# EAGLE design business card serial conway (EAGLE 9.2.2)
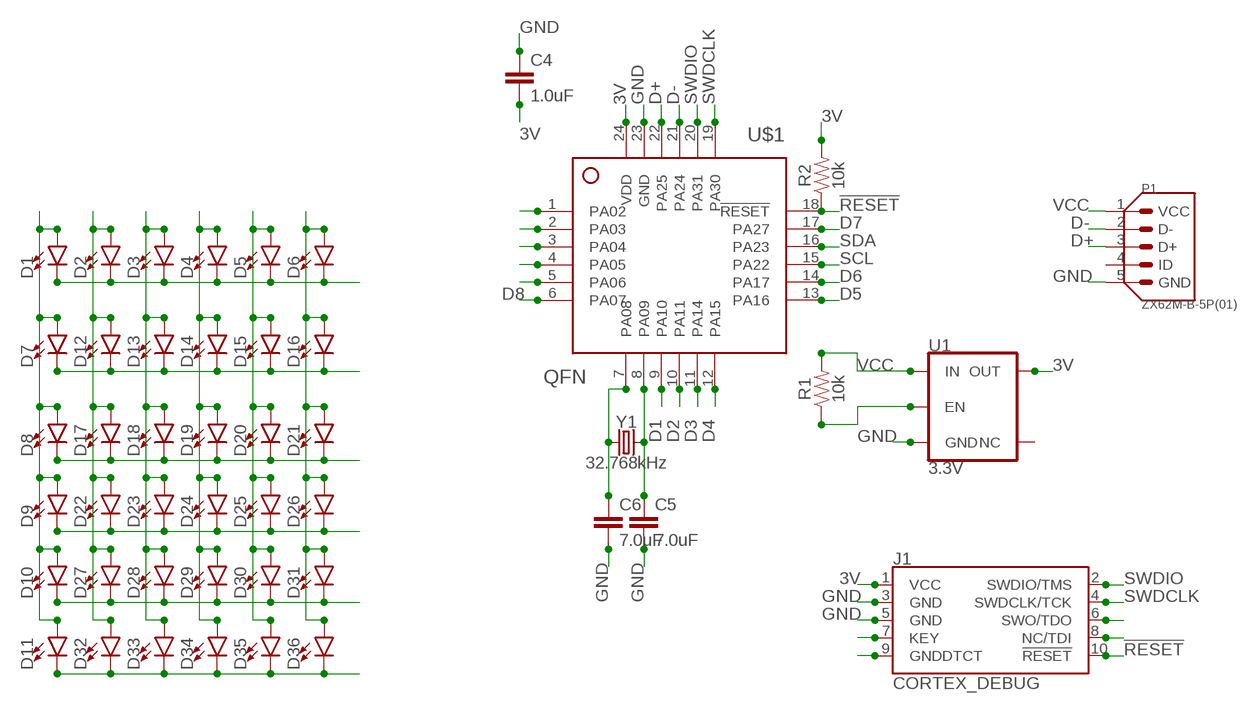
[diagram p0: schematic, sheet 1]

## Parts
C4  1.0uF  1.0UF-0402-16V-10%  [0402]
C5  7.0uF  1.0UF-0402-16V-10%  [0402]
C6  7.0uF  1.0UF-0402-16V-10%  [0402]
D1  LED0603  [LED-0603]
D2  LED0603  [LED-0603]
D3  LED0603  [LED-0603]
D4  LED0603  [LED-0603]
D5  LED0603  [LED-0603]
D6  LED0603  [LED-0603]
D7  LED0603  [LED-0603]
D8  LED0603  [LED-0603]
D9  LED0603  [LED-0603]
D10  LED0603  [LED-0603]
D11  LED0603  [LED-0603]
D12  LED0603  [LED-0603]
D13  LED0603  [LED-0603]
D14  LED0603  [LED-0603]
D15  LED0603  [LED-0603]
D16  LED0603  [LED-0603]
D17  LED0603  [LED-0603]
D18  LED0603  [LED-0603]
D19  LED0603  [LED-0603]
D20  LED0603  [LED-0603]
D21  LED0603  [LED-0603]
D22  LED0603  [LED-0603]
D23  LED0603  [LED-0603]
D24  LED0603  [LED-0603]
D25  LED0603  [LED-0603]
D26  LED0603  [LED-0603]
D27  LED0603  [LED-0603]
D28  LED0603  [LED-0603]
D29  LED0603  [LED-0603]
D30  LED0603  [LED-0603]
D31  LED0603  [LED-0603]
D32  LED0603  [LED-0603]
D33  LED0603  [LED-0603]
D34  LED0603  [LED-0603]
D35  LED0603  [LED-0603]
D36  LED0603  [LED-0603]
J1  CORTEX_DEBUG  CORTEX_DEBUG_PTH  [2X5-PTH-1.27MM]
P1  ZX62M-B-5P(01)  [HRS_ZX62M-B-5P(01)]
R1  10k  330OHM-0603-1/10W-1%  [0603]
R2  10k  330OHM-0603-1/10W-1%  [0603]
U1  3.3V  V_REG_AP2112K-3.3V  [SOT23-5]
U$1  QFN  [QFN24-4X4]
Y1  32.768kHz  CRYSTAL-32.768KHZSMD-3.2X1.5  [CRYSTAL-SMD-3.2X1.5MM]

## Nets
3V: C4.2 J1.1(VCC) R2.2 U1.5(OUT) U$1.24(VDD)
!RESET: J1.10(!RESET) R2.1 U$1.18(!RESET)
D1: U$1.9(PA10)
D2: U$1.10(PA11)
D3: U$1.11(PA14)
D4: U$1.12(PA15)
D5: U$1.13(PA16)
D6: U$1.14(PA17)
D7: U$1.17(PA27)
D8: U$1.6(PA07)
D+: P1.3(D+) U$1.22(PA25)
D-: P1.2(D-) U$1.21(PA24)
GND: C4.1 C5.2 C6.2 J1.3(GND) J1.5(GND) P1.5(GND) U1.2(GND) U$1.23(GND)
N$1: D1.C D2.C D3.C D4.C D5.C D6.C
N$2: C6.1 U$1.7(PA08) Y1.P$1
N$3: C5.1 U$1.8(PA09) Y1.P$2
N$4: J1.9(GNDDTCT)
N$5: R1.1 U1.3(EN)
N$6: D7.C D12.C D13.C D14.C D15.C D16.C
N$7: J1.8(NC/TDI)
N$8: D8.C D17.C D18.C D19.C D20.C D21.C
N$9: J1.7(KEY)
N$10: J1.6(SWO/TDO)
N$11: D9.C D22.C D23.C D24.C D25.C D26.C
N$12: D10.C D27.C D28.C D29.C D30.C D31.C
N$13: D11.C D32.C D33.C D34.C D35.C D36.C
N$14: D1.A D7.A D8.A D9.A D10.A D11.A
N$15: D2.A D12.A D17.A D22.A D27.A D32.A
N$16: D3.A D13.A D18.A D23.A D28.A D33.A
N$17: D4.A D14.A D19.A D24.A D29.A D34.A
N$18: D5.A D15.A D20.A D25.A D30.A D35.A
N$19: D6.A D16.A D21.A D26.A D31.A D36.A
N$21: U$1.1(PA02)
N$22: U$1.2(PA03)
N$23: U$1.3(PA04)
N$24: U$1.4(PA05)
N$25: U$1.5(PA06)
SCL: U$1.15(PA22)
SDA: U$1.16(PA23)
SWDCLK: J1.4(SWDCLK/TCK) U$1.19(PA30)
SWDIO: J1.2(SWDIO/TMS) U$1.20(PA31)
VCC: P1.1(VCC) R1.2 U1.1(IN)
Unconnected: P1.4(ID) U1.4(NC)

## Library data of the parts
C4 = SparkFun-Capacitors:1.0UF: 1µF ceramic capacitors A capacitor is a passive two-terminal electrical component used to store electrical energy temporarily in an electric field.; PROD_ID: CAP-12417
C5 C6 = SparkFun-Capacitors:1.0UF: 1µF ceramic capacitors A capacitor is a passive two-terminal electrical component used to store electrical energy temporarily in an electric field.; PROD_ID: CAP-12417; VALUE: 1.0uF
D1-D36 = SparkFun-LED:LED: LED (Generic) Standard schematic elements and footprints for 5mm, 3mm, 1206, and 0603 sized LEDs. Generic LEDs with no color specified.
J1 = SparkFun-Connectors:CORTEX_DEBUG: Cortex Debug Connector - 10 pin Supports JTAG debug, Serial Wire debug, and Serial Wire Viewer. PTH and SMD connector options available. General Connector Information <http://infocenter.arm.com/help/topic/com.arm.doc.faqs/attached/13634/cortex_debug_connectors.pdf> Products: PTH Connector <http://www.digikey.com/product-detail/en/cnc-tech/3220-10-0100-00/1175-1627-ND/3883661> -via Digi-Key SparkFun PSoc <https://www.sparkfun.com/products/13229> SparkFun T <https://www.sparkfun.com/products/13810>
P1 = ZX62M-B-5P_01_:ZX62M-B-5P(01): Conn Micro USB 2.0 Type B RCP 5 POS 0.65mm Solder RA SMD 5 Terminal 1 Port T/R; AVAILABILITY: Unavailable; DESCRIPTION: Conn Micro USB 2.0 Type B RCP 5 POS 0.65mm Solder RA SMD 5 Terminal 1 Port T/R; MF: Hirose; MP: ZX62M-B-5P_01_; PACKAGE: None; PRICE: None
R1 R2 = SparkFun-Resistors:330OHM: 330Ω resistor A resistor is a passive two-terminal electrical component that implements electrical resistance as a circuit element. Resistors act to reduce current flow, and, at the same time, act to lower voltage levels within circuits. - Wikipedia; PROD_ID: RES-00818; VALUE: 330
U1 = SparkFun-IC-Power:V_REG_AP2112: AP2112 - 600mA CMOS LDO Regulator w/ Enable The AP2112 is CMOS process low dropout linear regulator with enable function, the regulator delivers a guaranteed 600mA (min.) continuous load current. Features Output Voltage Accuracy: ±1.5% Output Current: 600mA (Min.) Foldback Short Current Protection: 50mA Enable Function to Turn ON/OFF VOUT Low Dropout Voltage (3.3V): 250mV (Typ.) @IOUT=600mA Excellent Load Regulation: 0.2%/A (Typ.) Excellent Line Regulation: 0.02%/V (Typ.) Low Quiescent Current: 55μA (Typ.) Low Standby Current: 0.01μA (Typ.) Low Output Noise: 50μVRMS PSRR: 100Hz -65dB, 1kHz -65dB OTSD Protection Stable with 1.0μF Flexible Cap: Ceramic, Tantalum and Aluminum Electrolytic Operation Temperature Range: -40°C to 85°C ESD: MM 400V, HBM 4000V; PROD_ID: VREG-12457
U$1 = SAMD11C14:QFN
Y1 = SparkFun-Clocks:CRYSTAL-32.768KHZ: 32.768kHz Crystal Frequency: 32.768kHz Frequency Stability: ±20ppm Load Capacitance: 12.5pF (PTH-2X6 & SMD-3.2X1.5), 6pF (SMD-2X6) SparkFun Products: SparkFun BigTime Watch Kit <https://www.sparkfun.com/products/11734> SparkFun nRF52832 Breakout <https://www.sparkfun.com/products/13990> SparkFun Real Time Clock Module <https://www.sparkfun.com/products/12708>; PROD_ID: XTAL-13062

## Board
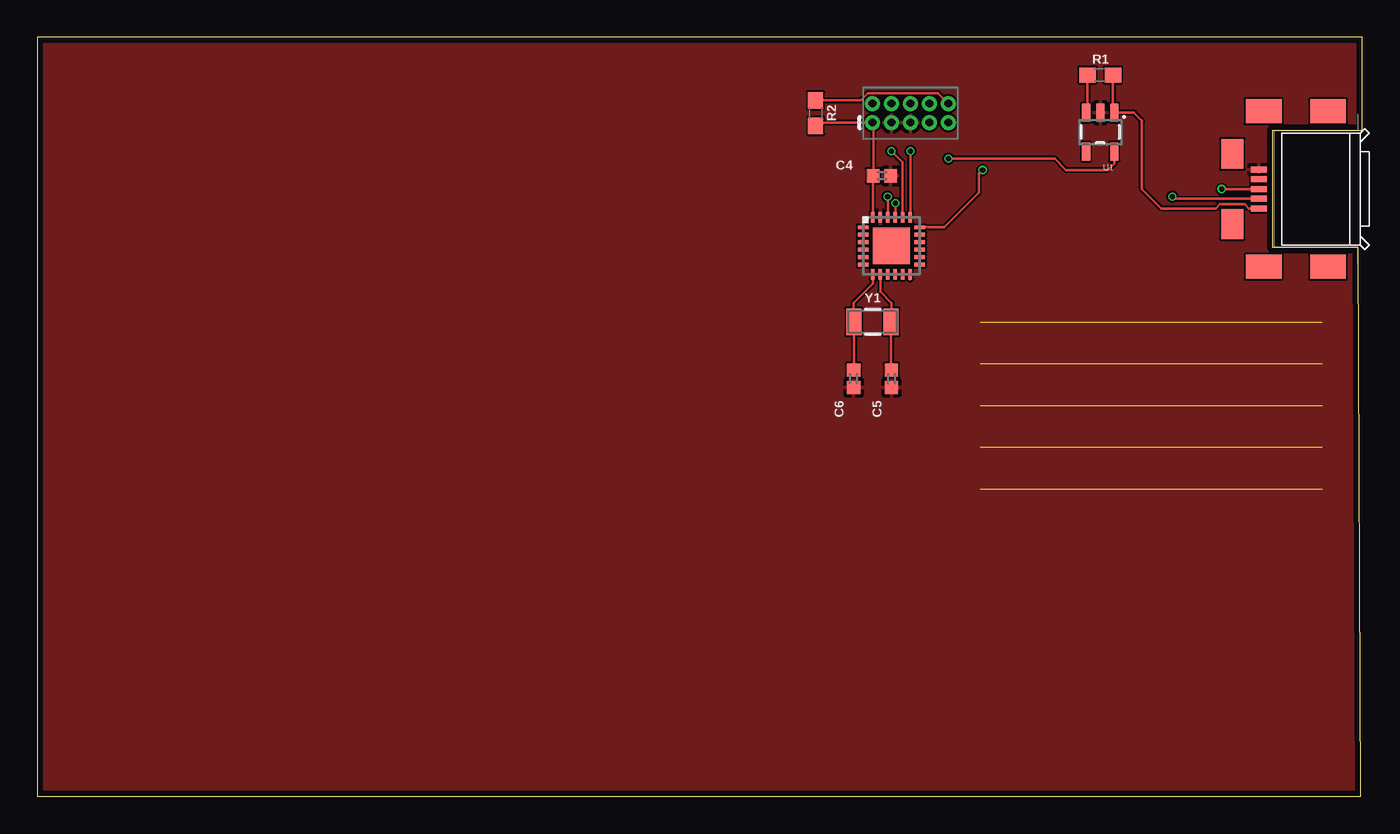
[diagram p1: board, top side]
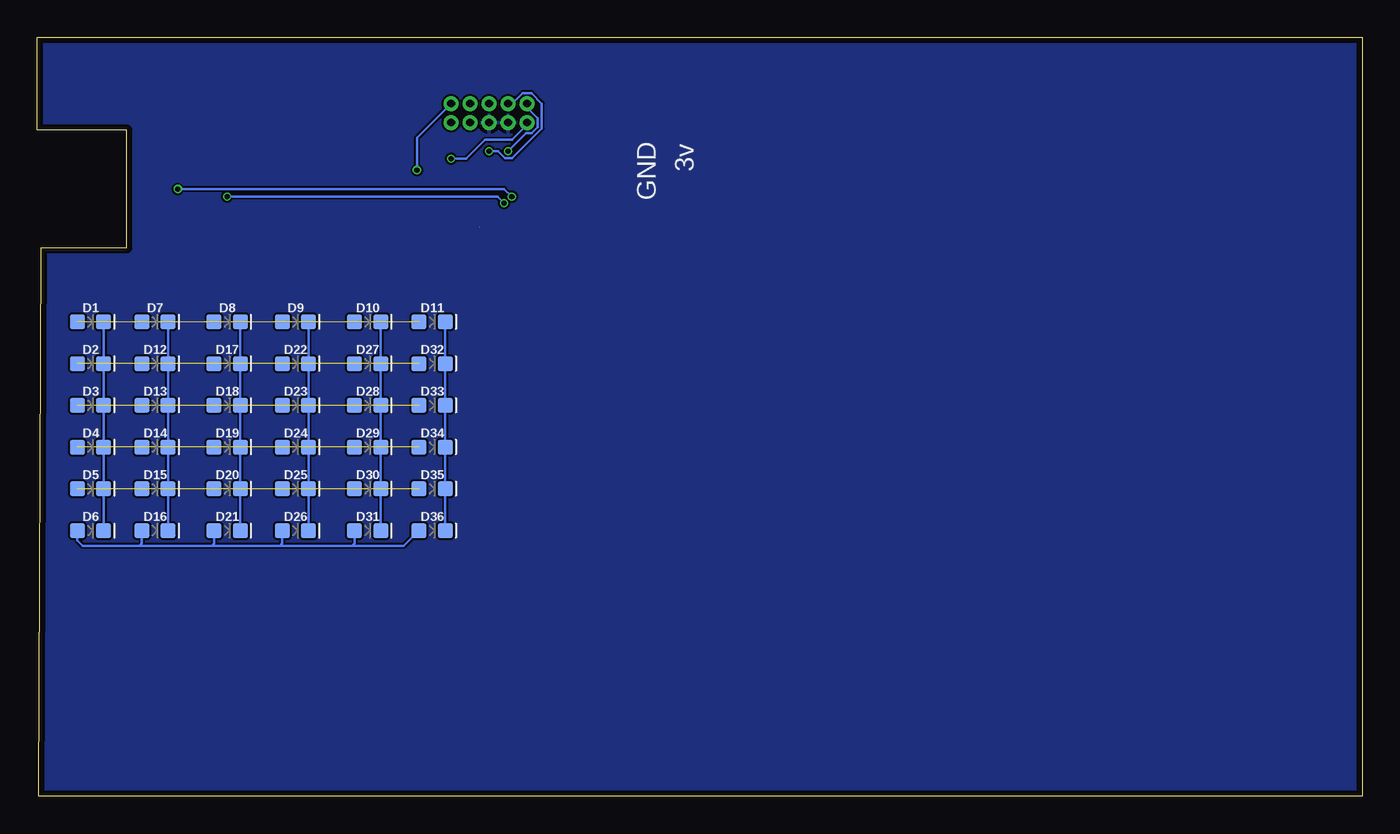
[diagram p2: board, bottom side, seen from below]

Size 88.65 x 50.79 mm. Coordinates in mm from the lower left corner, seen from the top.
Outline: 0,0 88.57,0 88.39,36.58 88.39,36.7 82.68,36.7 82.68,44.58 88.65,44.58 88.65,50.79 0,50.79 0,0
Copper layers (1*16): Top 0.035mm / dielectric 1.5mm / Bottom 0.035mm
Design rules "MF_Standard_2_Layer *": minimum track width 5mil, minimum drill 10mil, track to track 5mil, track to pad 5mil, pad to pad 5mil, via to via 5mil, smd to smd 0mil, copper to edge 15mil, drill to drill 10mil, minimum pad ring 4mil, minimum via ring 4mil, stop-mask expansion 2mil, vias tented up to drill 25mil, thermal gap 10mil

### Footprints (pad centres in the part's own frame; a part is rotated, then mirrored left to right if it is on the bottom)
0402 = smd 0.85 x 0.9: 1 -0.58,0; 2 0.58,0
LED-0603 = smd 1 x 1: A -0.877,0; C 0.877,0
2X5-PTH-1.27MM = drill 0.508 pad 1: 1 -2.54,-0.635; 2 -2.54,0.635; 3 -1.27,-0.635; 4 -1.27,0.635; 5 0,-0.635; 6 0,0.635; 7 1.27,-0.635; 8 1.27,0.635; 9 2.54,-0.635; 10 2.54,0.635
HRS_ZX62M-B-5P(01) = smd 0.4 x 1.05: 1 -1.3,3.355; 2 -0.65,3.355; 3 0,3.355; 4 0.65,3.355; 5 1.3,3.355 | smd 1.6 x 2.4: S1 5.2,-1.27; S2 -5.2,-1.27; S3 -5.2,3.03; S6 5.2,3.03 | smd 2 x 1.5: S4 -2.35,5.13; S5 2.35,5.13
0603 = smd 1.1 x 1: 1 -0.85,0; 2 0.85,0
SOT23-5 = smd 0.55 x 1.2: 1 -0.95,-1.3; 2 0,-1.3; 3 0.95,-1.3; 4 0.95,1.3; 5 -0.95,1.3
QFN24-4X4 = smd 0.7 x 0.25: 1 -1.9,1.25; 2 -1.9,0.75; 3 -1.9,0.25; 4 -1.9,-0.25; 5 -1.9,-0.75; 6 -1.9,-1.25; 13 1.9,-1.25; 14 1.9,-0.75; 15 1.9,-0.25; 16 1.9,0.25; 17 1.9,0.75; 18 1.9,1.25 | smd 0.25 x 0.7: 7 -1.25,-1.9; 8 -0.75,-1.9; 9 -0.25,-1.9; 10 0.25,-1.9; 11 0.75,-1.9; 12 1.25,-1.9; 19 1.25,1.9; 20 0.75,1.9; 21 0.25,1.9; 22 -0.25,1.9; 23 -0.75,1.9; 24 -1.25,1.9 | smd 2.45 x 2.45: EXP 0,0
CRYSTAL-SMD-3.2X1.5MM = smd 1 x 1.8: P$1 -1.25,0; P$2 1.25,0

### Placement (x,y rotation side)
C4  56.52,41.53 180 top
C5  57.15,27.94 270 top
C6  54.61,27.94 270 top
D1  85.09,31.75 0 bottom
D2  85.09,28.96 0 bottom
D3  85.09,26.16 0 bottom
D4  85.09,23.37 0 bottom
D5  85.09,20.57 0 bottom
D6  85.09,17.78 0 bottom
D7  80.77,31.75 0 bottom
D8  75.95,31.75 0 bottom
D9  71.37,31.75 0 bottom
D10  66.55,31.75 0 bottom
D11  62.23,31.75 0 bottom
D12  80.77,28.96 0 bottom
D13  80.77,26.16 0 bottom
D14  80.77,23.37 0 bottom
D15  80.77,20.57 0 bottom
D16  80.77,17.78 0 bottom
D17  75.95,28.96 0 bottom
D18  75.95,26.16 0 bottom
D19  75.95,23.37 0 bottom
D20  75.95,20.57 0 bottom
D21  75.95,17.78 0 bottom
D22  71.37,28.96 0 bottom
D23  71.37,26.16 0 bottom
D24  71.37,23.37 0 bottom
D25  71.37,20.57 0 bottom
D26  71.37,17.78 0 bottom
D27  66.55,28.96 0 bottom
D28  66.55,26.16 0 bottom
D29  66.55,23.37 0 bottom
D30  66.55,20.57 0 bottom
D31  66.55,17.78 0 bottom
D32  62.23,28.96 0 bottom
D33  62.23,26.16 0 bottom
D34  62.23,23.37 0 bottom
D35  62.23,20.57 0 bottom
D36  62.23,17.78 0 bottom
J1  58.42,45.72 0 top
P1  85.09,40.64 90 top
R1  71.12,48.26 0 top
R2  52.07,45.72 270 top
U1  71.12,44.45 180 top
U$1  57.15,36.83 0 top
Y1  55.88,31.75 0 top

### Tracks (layer width: path | path; a pad name or v marks a point on that pad's centre or on a via)
3V  (via drill 0.35)
  Top 0.152: U$1.24 55.9,41.49 C4.2 55.94,45.03 J1.1 52.28,45.09 R2.2 52.07,44.45 | U1.5 72.07,42.35 71.63,41.91 68.83,41.91 68.07,42.67 v60.96,42.67
  Bottom 0.152: v60.96,42.67 59.94,42.67 58.67,43.94 56.9,43.94 55.88,44.96 J1.1
!RESET  (via drill 0.35)  (1 unrouted)
  Top 0.152: R2.1 55.1,46.57 55.59,47.06 60.26,47.06 J1.10 | 59.07,38.1 60.71,38.1 62.99,40.39 62.99,41.66 v63.25,41.91
  Bottom 0.152: v63.25,41.91 63.25,44.07 J1.10
D1
  Top 0.127: 57.02,34.92 U$1.9
D2
  Top 0.127: 57.4,34.67 U$1.10
D3
  Top 0.127: 57.91,34.67 57.91,34.92 U$1.11
D4
  Top 0.152: U$1.12 58.4,34.56
D5
  Top 0.127: 59.05,35.56 U$1.13
D6
  Top 0.127: 59.05,36.07 U$1.14
D8
  Top 0.127: 55.23,35.56 U$1.6
D+  (via drill 0.35)
  Top 0.152: U$1.22 56.9,39.87 56.9,39.88 v56.9,40.13 | v79.25,40.64 P1.3
  Bottom 0.152: v56.9,40.13 57.4,40.64 v79.25,40.64
D-  (via drill 0.35)
  Top 0.152: U$1.21 57.4,39.37 57.4,39.68 v57.42,39.69 | v75.95,40.13 76.09,39.99 P1.2
  Bottom 0.152: v57.42,39.69 57.86,40.13 v75.95,40.13
GND
  pour Top: 0,50.8 88.9,50.8 88.9,0 0,0
  pour Bottom: 0,50.8 89.15,50.8 89.15,-3.81 0,-3.81
N$1
  Bottom 0.152: D1.C D2.C D3.C D4.C D5.C D6.C
N$2
  Top 0.152: U$1.7 55.9,34.31 54.61,33.02 54.61,31.77 Y1.P$1 54.63,28.54 C6.1
N$3
  Top 0.152: U$1.8 56.4,33.77 57.15,33.02 57.15,31.77 Y1.P$2 57.13,28.54 C5.1
N$5
  Top 0.152: R1.1 70.27,45.85 U1.3
N$6
  Bottom 0.152: D16.C D15.C D14.C D13.C D12.C D7.C
N$8
  Bottom 0.152: D8.C D17.C D18.C D19.C D20.C D21.C
N$11
  Bottom 0.152: D26.C D25.C D24.C D23.C D22.C D9.C
N$12
  Bottom 0.152: D10.C D27.C D28.C D29.C D30.C D31.C
N$13
  Bottom 0.152: D11.C D32.C D33.C D34.C D35.C D36.C
N$14  (5 unrouted)
N$15  (5 unrouted)
N$16  (5 unrouted)
N$17  (5 unrouted)
N$18  (5 unrouted)
N$19
  Bottom 0.152: D36.A 64.12,16.76 67.56,16.76 | 67.56,16.76 72.39,16.76 | 72.39,16.76 76.96,16.76 | 76.96,16.76 81.79,16.76 | 81.79,16.76 85.6,16.76 85.97,17.13 D6.A | D16.A 81.65,16.9 81.79,16.76 | D21.A 76.82,16.9 76.96,16.76 | D26.A 72.25,16.9 72.39,16.76 | D31.A 67.42,16.9 67.56,16.76
N$21
  Top 0.127: 55.24,38.1 U$1.1
N$22
  Top 0.127: 55.24,37.59 U$1.2
N$23
  Top 0.127: U$1.3
N$24
  Top 0.127: U$1.4
N$25
  Top 0.127: U$1.5 55.24,36.07
SCL
  Top 0.127: U$1.15
SWDCLK  (via drill 0.35)
  Top 0.152: U$1.19 58.42,38.75 v58.42,43.18
  Bottom 0.152: v58.42,43.18 57.83,43.18 57.35,42.7 56.88,42.7 54.9,44.68 54.9,46.37 55.59,47.06 56.17,47.06 56.87,46.35 J1.4
SWDIO  (via drill 0.35)
  Top 0.152: U$1.20 57.9,42.43 v57.15,43.18
  Bottom 0.152: v57.15,43.18 55.95,44.38 55.59,44.38 55.18,44.79 55.18,45.38 55.88,46.08 J1.2
VCC
  Top 0.152: R1.2 71.97,45.85 U1.1 73.38,45.75 73.91,45.21 73.91,40.64 75.21,39.34 78.85,39.34 79.13,39.62 80.79,39.62 81.07,39.34 P1.1

### Text on the board
bNames: 3v | GND
tStop: Michael Bales | CEO | Santa Barbara Hackerspace, Inc. | 5782 Thornwood Drive | Goleta, CA 93117 | (805) 242-2533 | mbales@sbhackerspace.com